# EAGLE design Servo-SMD (EAGLE 7.5.0)
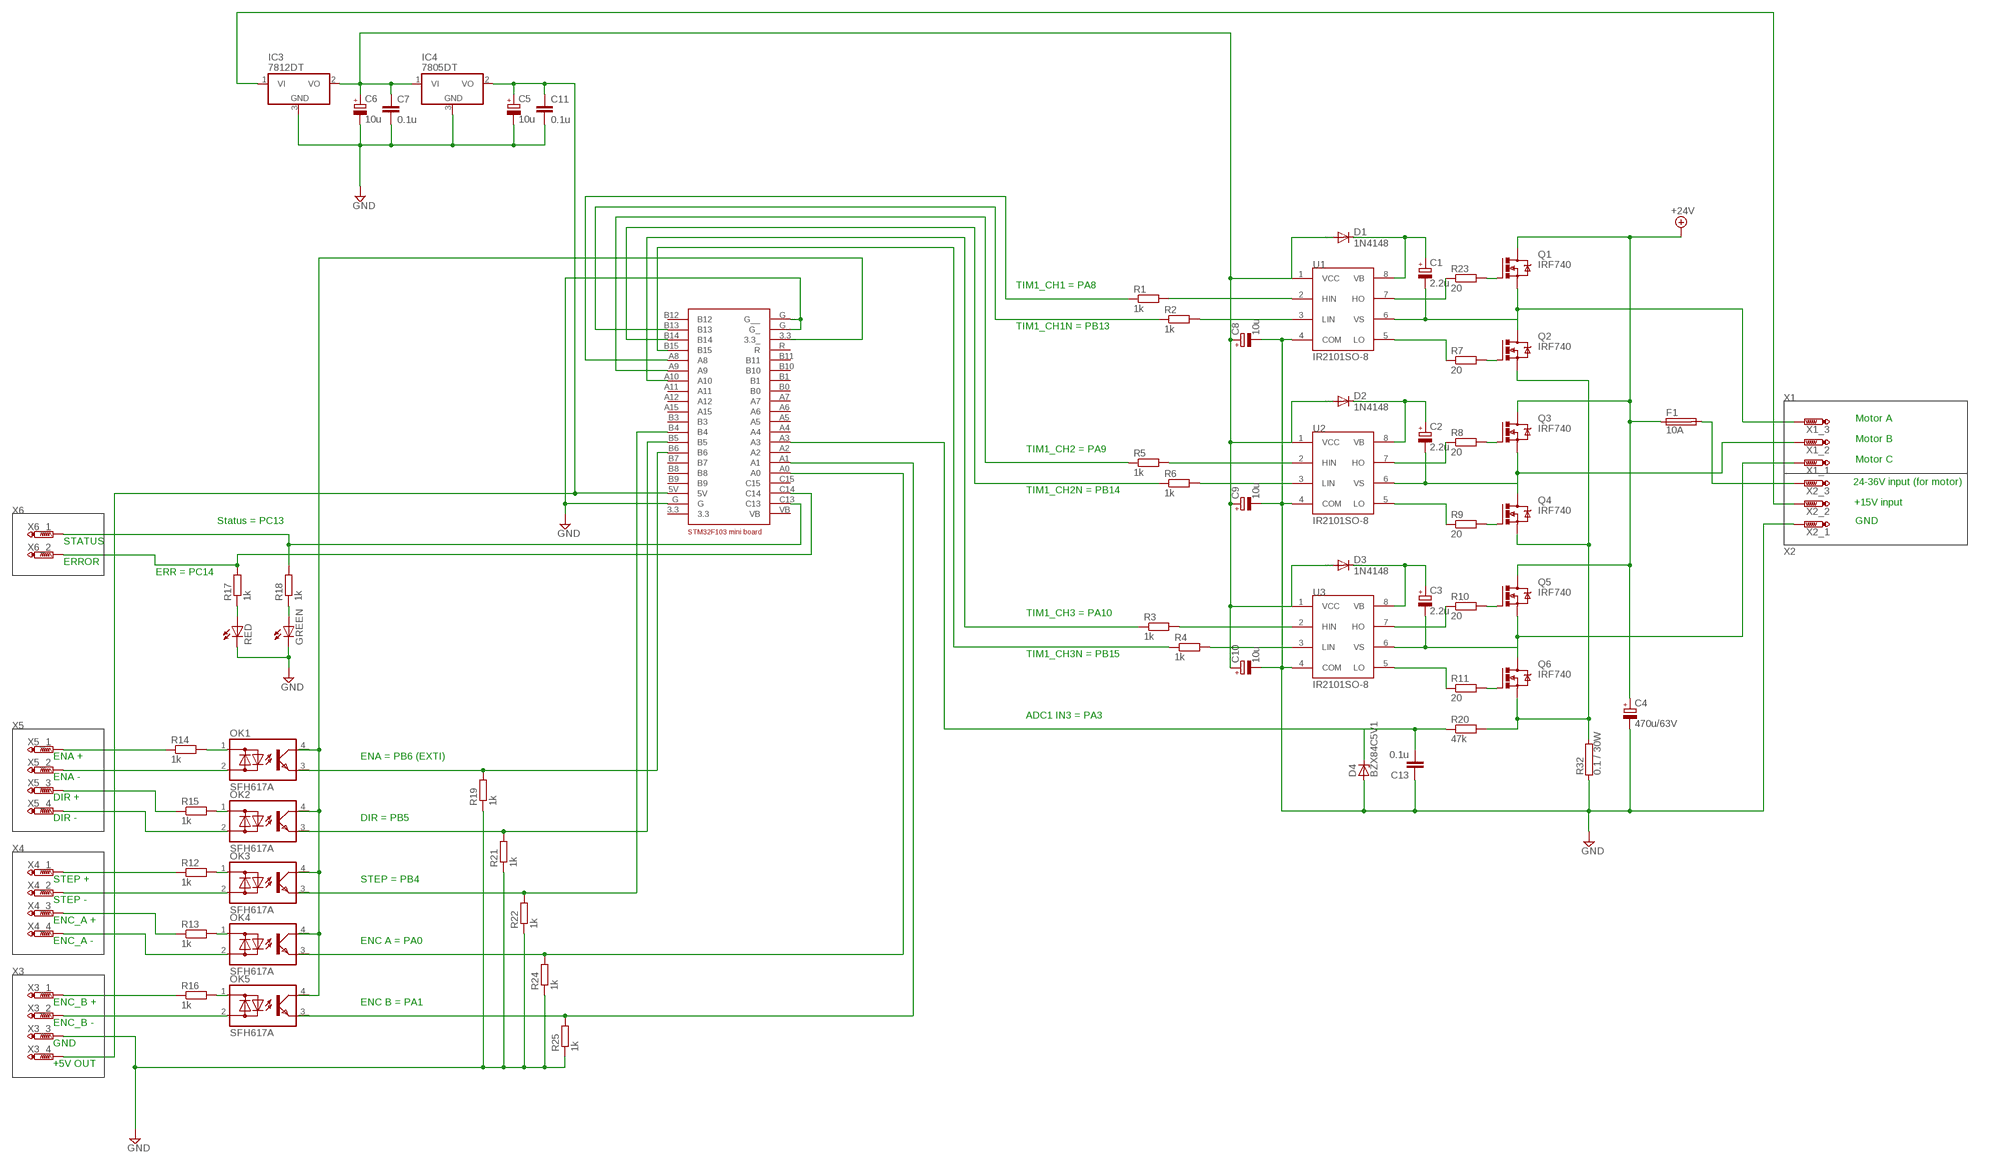
[diagram p0: schematic, sheet 1]

## Parts
C1  2.2u  CPOL-EUSANYO_SMD_C6  [SANYO-OSCON_SMD_C6]
C2  2.2u  CPOL-EUSANYO_SMD_C6  [SANYO-OSCON_SMD_C6]
C3  2.2u  CPOL-EUSANYO_SMD_C6  [SANYO-OSCON_SMD_C6]
C4  470u/63V  CPOL-EUE5-13  [E5-13]
C5  10u  CPOL-EUSANYO_SMD_C6  [SANYO-OSCON_SMD_C6]
C6  10u  CPOL-EUSANYO_SMD_C6  [SANYO-OSCON_SMD_C6]
C7  0.1u  C-EUC0805  [C0805]
C8  10u  CPOL-EUSANYO_SMD_C6  [SANYO-OSCON_SMD_C6]
C9  10u  CPOL-EUSANYO_SMD_C6  [SANYO-OSCON_SMD_C6]
C10  10u  CPOL-EUSANYO_SMD_C6  [SANYO-OSCON_SMD_C6]
C11  0.1u  C-EUC0805  [C0805]
C13  0.1u  C-EUC0805  [C0805]
D1  1N4148  CGRM4001-G  [SOD-123_MINI-SMA]
D2  1N4148  CGRM4001-G  [SOD-123_MINI-SMA]
D3  1N4148  CGRM4001-G  [SOD-123_MINI-SMA]
D4  BZX84C5V1  BZX84CSMD  [TO236]
F1  10A  FUSESHK20L  [SHK20L]
GREEN  LEDSML0805  [SML0805]
IC3  7812DT  7805DT  [TO252]
IC4  7805DT  7812DT  [TO252]
OK1  SFH617A  SFH6206  [DIL4-SMD]
OK2  SFH617A  SFH6206  [DIL4-SMD]
OK3  SFH617A  SFH6206  [DIL4-SMD]
OK4  SFH617A  SFH6206  [DIL4-SMD]
OK5  SFH617A  SFH6206  [DIL4-SMD]
Q1  IRF740  [TO220BV]
Q2  IRF740  [TO220BV]
Q3  IRF740  [TO220BV]
Q4  IRF740  [TO220BV]
Q5  IRF740  [TO220BV]
Q6  IRF740  [TO220BV]
R1  1k  R-EU_M0805  [M0805]
R2  1k  R-EU_M0805  [M0805]
R3  1k  R-EU_M0805  [M0805]
R4  1k  R-EU_M0805  [M0805]
R5  1k  R-EU_M0805  [M0805]
R6  1k  R-EU_M0805  [M0805]
R7  20  R-EU_M0805  [M0805]
R8  20  R-EU_M0805  [M0805]
R9  20  R-EU_M0805  [M0805]
R10  20  R-EU_M0805  [M0805]
R11  20  R-EU_M0805  [M0805]
R12  1k  R-EU_M0805  [M0805]
R13  1k  R-EU_M0805  [M0805]
R14  1k  R-EU_M0805  [M0805]
R15  1k  R-EU_M0805  [M0805]
R16  1k  R-EU_M0805  [M0805]
R17  1k  R-EU_M0805  [M0805]
R18  1k  R-EU_M0805  [M0805]
R19  1k  R-EU_M0805  [M0805]
R20  47k  R-EU_M0805  [M0805]
R21  1k  R-EU_M0805  [M0805]
R22  1k  R-EU_M0805  [M0805]
R23  20  R-EU_M0805  [M0805]
R24  1k  R-EU_M0805  [M0805]
R25  1k  R-EU_M0805  [M0805]
R32  0.1 / 30W  R  [TO220-2]
RED  LEDSML0805  [SML0805]
U1  IR2101SO-8  [SO-8]
U2  IR2101SO-8  [SO-8]
U3  IR2101SO-8  [SO-8]
U$1  STM32F108  [STB32F108BRD]
X1_1  PTR1PAD1-13Y  [P1-13Y]
X1_2  PTR1PAD1-13Y  [P1-13Y]
X1_3  PTR1PAD1-13Y  [P1-13Y]
X2_1  PTR1PAD1-13Y  [P1-13Y]
X2_2  PTR1PAD1-13Y  [P1-13Y]
X2_3  PTR1PAD1-13Y  [P1-13Y]
X3_1  PTR1PAD1-13Y  [P1-13Y]
X3_2  PTR1PAD1-13Y  [P1-13Y]
X3_3  PTR1PAD1-13Y  [P1-13Y]
X3_4  PTR1PAD1-13Y  [P1-13Y]
X4_1  PTR1PAD1-13Y  [P1-13Y]
X4_2  PTR1PAD1-13Y  [P1-13Y]
X4_3  PTR1PAD1-13Y  [P1-13Y]
X4_4  PTR1PAD1-13Y  [P1-13Y]
X5_1  PTR1PAD1-13Y  [P1-13Y]
X5_2  PTR1PAD1-13Y  [P1-13Y]
X5_3  PTR1PAD1-13Y  [P1-13Y]
X5_4  PTR1PAD1-13Y  [P1-13Y]
X6_1  PTR1PAD1-13Y  [P1-13Y]
X6_2  PTR1PAD1-13Y  [P1-13Y]

## Nets
+12V: IC3.1(VI) X2_2.TP
+24V: C4.+ F1.1A Q1.D Q3.D Q5.D
GND: C4.- C5.- C6.- C7.2 C8.- C9.- C10.- C11.2 C13.1 D4.A GREEN.C IC3.3(GND) IC4.3(GND) R19.1 R21.1 R22.1 R24.1 R25.1 R32.P$1 RED.C U1.4(COM) U2.4(COM) U3.4(COM) U$1.G U$1.G_ U$1.G__ X2_1.TP X3_3.TP
N$1: OK3.1(AC1) R12.2
N$2: OK4.1(AC1) R13.2
N$3: R1.1 U$1.A8
N$4: R2.1 U$1.B13
N$5: R5.1 U$1.A9
N$6: R6.1 U$1.B14
N$7: R3.1 U$1.A10
N$8: R4.1 U$1.B15
N$9: R2.2 U1.3(LIN)
N$10: R1.2 U1.2(HIN)
N$11: R5.2 U2.2(HIN)
N$12: R6.2 U2.3(LIN)
N$13: R4.2 U3.3(LIN)
N$14: R3.2 U3.2(HIN)
N$15: R23.1 U1.7(HO)
N$16: OK1.1(AC1) R14.2
N$17: R7.1 U1.5(LO)
N$18: R9.1 U2.5(LO)
N$19: R8.1 U2.7(HO)
N$20: R10.1 U3.7(HO)
N$21: R11.1 U3.5(LO)
N$22: C1.- Q1.S Q2.D U1.6(VS) X1_3.TP
N$23: C2.- Q3.S Q4.D U2.6(VS) X1_2.TP
N$24: C3.- Q5.S Q6.D U3.6(VS) X1_1.TP
N$25: Q1.G R23.2
N$26: Q2.G R7.2
N$27: Q3.G R8.2
N$28: Q4.G R9.2
N$29: Q5.G R10.2
N$30: Q6.G R11.2
N$31: OK2.1(AC1) R15.2
N$32: C5.+ C11.1 IC4.2(VO) U$1.5V X3_4.TP
N$33: OK5.1(AC1) R16.2
N$34: R12.1 X4_1.TP
N$35: OK3.2(AC2) X4_2.TP
N$36: R13.1 X4_3.TP
N$37: OK4.2(AC2) X4_4.TP
N$38: R14.1 X5_1.TP
N$39: OK1.2(AC2) X5_2.TP
N$40: Q2.S Q4.S Q6.S R20.2 R32.P$2
N$41: R15.1 X5_3.TP
N$42: OK2.2(AC2) X5_4.TP
N$43: R16.1 X3_1.TP
N$44: OK5.2(AC2) X3_2.TP
N$45: OK1.4(C) OK2.4(C) OK3.4(C) OK4.4(C) OK5.4(C) U$1.3.3_
N$46: OK5.3(E) R25.2 U$1.A1
N$47: OK4.3(E) R24.2 U$1.A0
N$48: OK3.3(E) R22.2 U$1.B4
N$49: OK2.3(E) R21.2 U$1.B5
N$50: OK1.3(E) R19.2 U$1.B6
N$51: R17.2 U$1.C14 X6_2.TP
N$52: R18.2 U$1.C13 X6_1.TP
N$53: R17.1 RED.A
N$54: GREEN.A R18.1
N$57: F1.2A X2_3.TP
N$59: C13.2 D4.C R20.1 U$1.A3
VB1: C1.+ D1.C U1.8(VB)
VB2: C2.+ D2.C U2.8(VB)
VB3: C3.+ D3.C U3.8(VB)
VCC: C6.+ C7.1 C8.+ C9.+ C10.+ D1.A D2.A D3.A IC3.2(VO) IC4.1(VI) U1.1(VCC) U2.1(VCC) U3.1(VCC)
Unconnected: U$1.3.3 U$1.A2 U$1.A4 U$1.A5 U$1.A6 U$1.A7 U$1.A11 U$1.A12 U$1.A15 U$1.B0 U$1.B1 U$1.B3 U$1.B7 U$1.B8 U$1.B9 U$1.B10 U$1.B11 U$1.B12 U$1.C15 U$1.R U$1.VB

## Notes on the sheet
- TIM1_CH1 = PA8
- TIM1_CH1N = PB13
- X1
- Motor A
- Motor B
- TIM1_CH2 = PA9
- Motor C
- 24-36V input (for motor)
- TIM1_CH2N = PB14
- +15V input
- X6
- Status = PC13 | GND
- STATUS
- X2
- ERROR
- ERR = PC14
- TIM1_CH3 = PA10
- TIM1_CH3N = PB15
- ADC1 IN3 = PA3
- X5
- ENA + | ENA = PB6 (EXTI)
- ENA -
- DIR +
- DIR - | DIR = PB5
- X4
- STEP + | STEP = PB4
- STEP -
- ENC_A +
- ENC_A - | ENC A = PA0
- X3
- ENC_B + | ENC B = PA1
- ENC_B -
- GND
- +5V OUT

## Library data of the parts
C1-C6 C8-C10 = rcl:CPOL-EU: POLARIZED CAPACITOR, European symbol
C7 C11 C13 = rcl:C-EU: CAPACITOR, European symbol
D1-D3 = diode:CGRM400*-G: Molded plasitc,JEDEC SOD-123/Mini SMA Source: Comchip CGRM4001-G.pdf
D4 = diode:BZX84CSMD: Z DIODE
F1 = fuse:FUSE: Fuse; OC_FARNELL: unknown; OC_NEWARK: unknown
GREEN RED = led:LED: LED OSRAM: - CHIPLED LG R971, LG N971, LY N971, LG Q971, LY Q971, LO R971, LY R971 LH N974, LH R974 LS Q976, LO Q976, LY Q976 LO Q996 - Hyper CHIPLED LW Q18S LB Q993, LB Q99A, LB R99A - SideLED LS A670, LO A670, LY A670, LG A670, LP A670 LB A673, LV A673, LT A673, LW A673 LH A674 LY A675 LS A676, LA A676, LO A676, LY A676, LW A676 LS A679, LY A679, LG A679 - Hyper Micro SIDELED® LS Y876, LA Y876, LO Y876, LY Y876 LT Y87S - SmartLED LW L88C, LW L88S LB L89C, LB L89S, LG L890 LS L89K, LO L89K, LY L89K LS L896, LA L896, LO L896, LY L896 - TOPLED LS T670, LO T670, LY T670, LG T670, LP T670 LSG T670, LSP T670, LSY T670, LOP T670, LYG T670 LG T671, LOG T671, LSG T671 LB T673, LV T673, LT T673, LW T673 LH T674 LS T676, LA T676, LO T676, LY T676, LB T676, LH T676, LSB T676, LW T676 LB T67C, LV T67C, LT T67C, LS T67K, LO T67K, LY T67K, LW E67C LS E67B, LA E67B, LO E67B, LY E67B, LB E67C, LV E67C, LT E67C LW T67C LS T679, LY T679, LG T679 LS T770, LO T770, LY T770, LG T770, LP T770 LB T773, LV T773, LT T773, LW T773 LH T774 LS E675, LA E675, LY E675, LS T675 LS T776, LA T776, LO T776, LY T776, LB T776 LHGB T686 LT T68C, LB T68C - Hyper Mini TOPLED® LB M676 - Mini TOPLED Santana® LG M470 LS M47K, LO M47K, LY M47K Source: http://www.osram.convergy.de LUXEON: - LUMILED® LXK2-PW12-R00, LXK2-PW12-S00, LXK2-PW14-U00, LXK2-PW14-V00 LXK2-PM12-R00, LXK2-PM12-S00, LXK2-PM14-U00 LXK2-PE12-Q00, LXK2-PE12-R00, LXK2-PE12-S00, LXK2-PE14-T00, LXK2-PE14-U00 LXK2-PB12-K00, LXK2-PB12-L00, LXK2-PB12-M00, LXK2-PB14-N00, LXK2-PB14-P00, LXK2-PB14-Q00 LXK2-PR12-L00, LXK2-PR12-M00, LXK2-PR14-Q00, LXK2-PR14-R00 LXK2-PD12-Q00, LXK2-PD12-R00, LXK2-PD12-S00 LXK2-PH12-R00, LXK2-PH12-S00 LXK2-PL12-P00, LXK2-PL12-Q00, LXK2-PL12-R00 Source: www.luxeon.com KINGBRIGHT: KA-3528ASYC Source: www.kingbright.com
IC3 IC4 = linear:78*: Positive VOLTAGE REGULATOR Source: http://cache.national.com/ds/LM/LM78L05.pdf http://www.fairchildsemi.com/ds/LM/LM7805.pdf
OK1-OK5 = optocoupler:SFH620: Optocoupler, Phototransistor Output, AC Input Source: http://www.vishay.com/docs/83675/sfh620.pdf; MF: VISHAY/TELEFUNKEN; MPN: SFH6206-3; OC_FARNELL: 1469585; OC_NEWARK: 58K2214
Q1-Q6 = transistor-power:IRF740: N-CHANNEL MOS FET
R1-R6 R12-R22 R24 R25 = resistor:R-EU_: RESISTOR, European symbol
R7-R11 R23 = rcl:R-EU_: RESISTOR, European symbol
R32 = TO220-Resistor:R: Power Resitor
U1-U3 = irf:IR2101: High and low side driver
U$1 = ATMega644:STM32F108
X1_1-X1_3 X2_1-X2_3 X3_1-X3_4 X4_1-X4_4 X5_1-X5_4 X6_1 X6_2 = testpad:PTR1: TEST PIN

## Net classes
0 default: clearance 0.205 mm

## Board
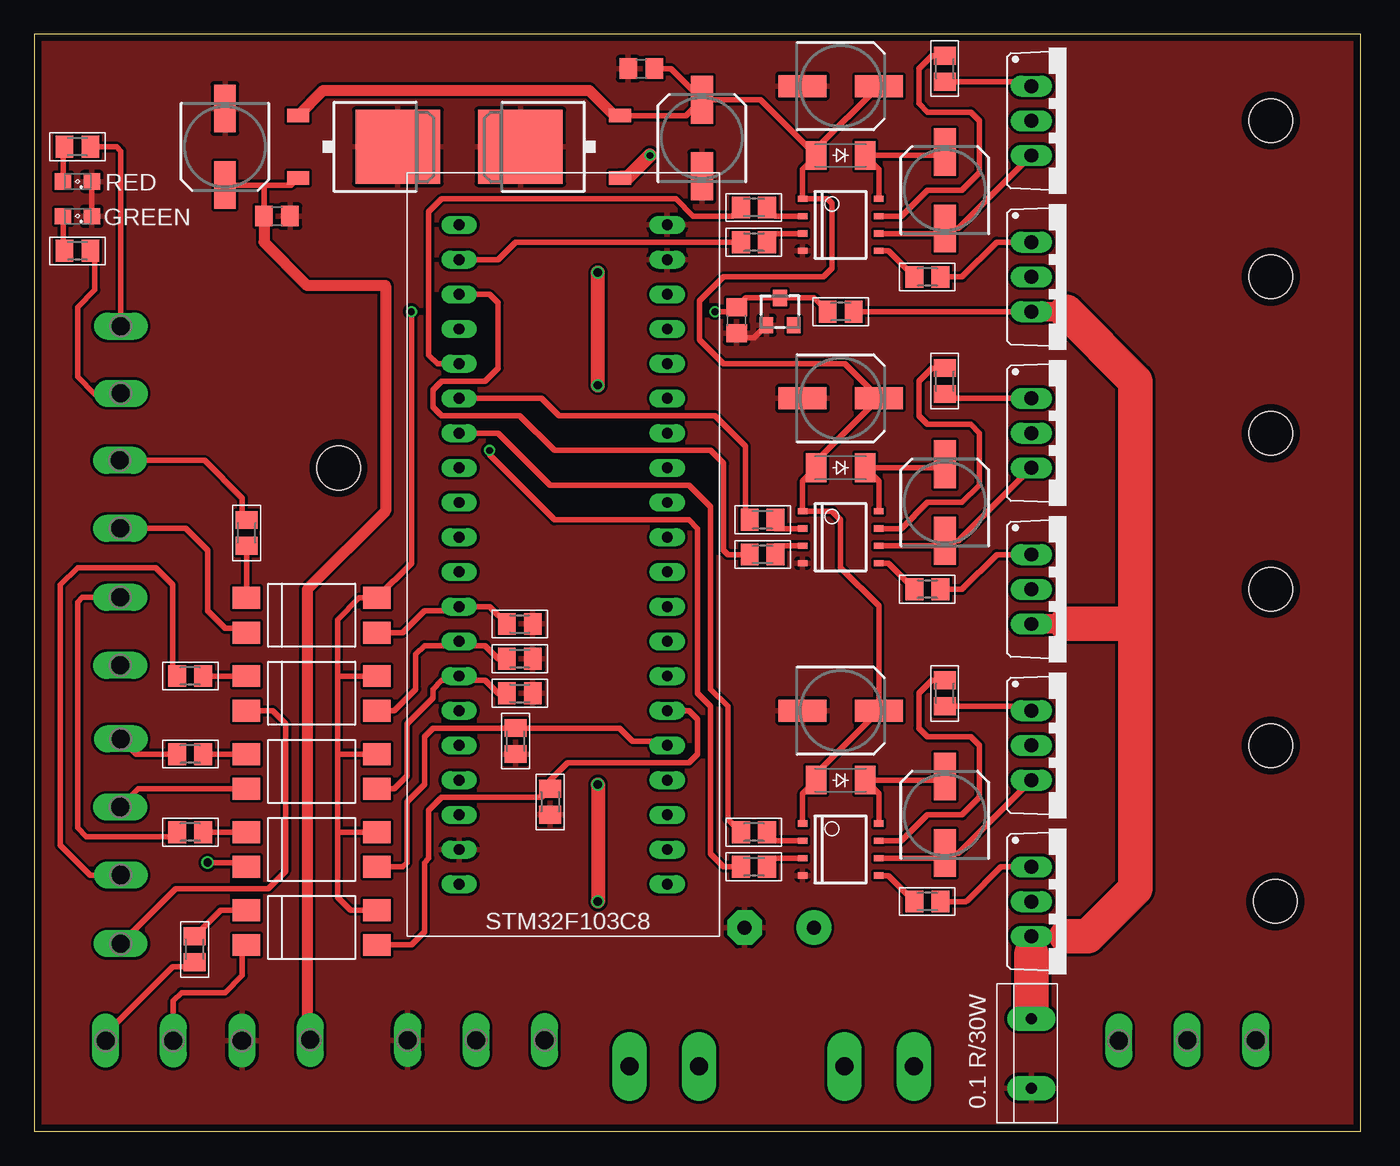
[diagram p1: board, top side]
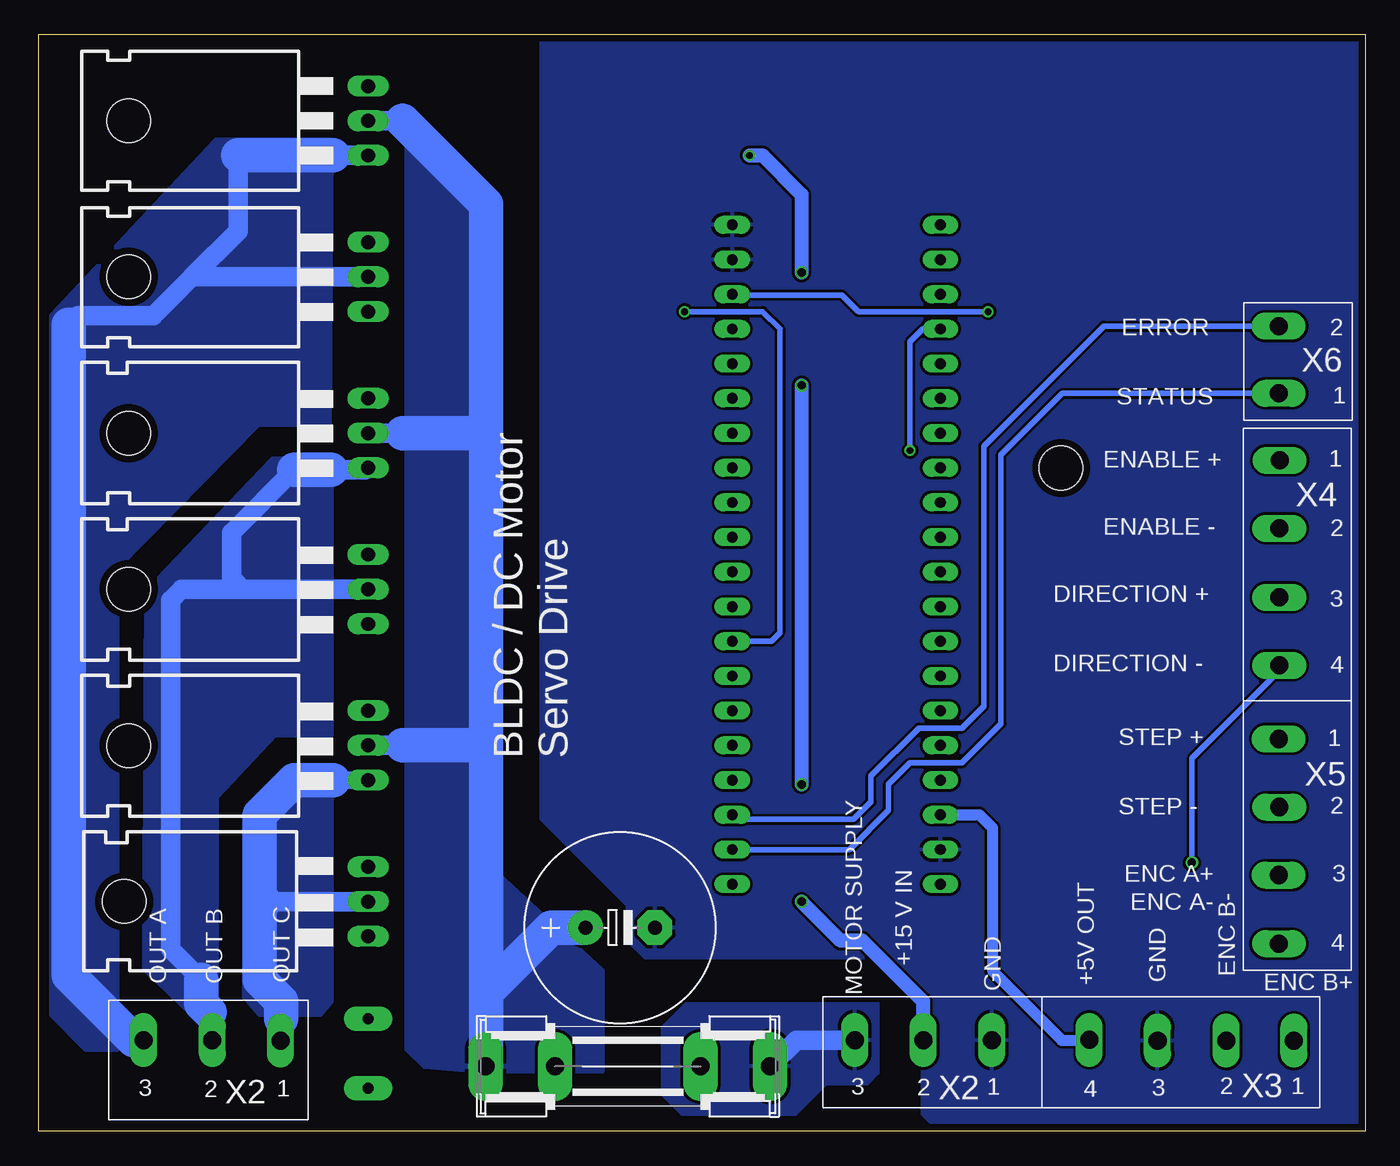
[diagram p2: board, bottom side, seen from below]

Size 97.14 x 80.32 mm. Coordinates in mm from the lower left corner, seen from the top.
Outline: 0,0 97.14,0 97.14,80.32 0,80.32 0,0
Copper layers (1*16): Top 0.035mm / dielectric 1.5mm / Bottom 0.035mm
Design rules "EagleRules": minimum track width 7mil, minimum drill 12mil, track to track 7mil, track to pad 7mil, pad to pad 7mil, via to via 7mil, smd to smd 0mil, copper to edge 20mil, drill to drill 10mil, minimum pad ring 10mil, minimum via ring 6mil, stop-mask expansion 2mil, vias tented up to drill 25mil, thermal gap 10mil
Holes 3.2 mm at 90.55,73.99 90.55,62.56 90.55,51.1 90.55,39.7 90.55,28.24 90.88,16.84 22.29,48.56

### Footprints (pad centres in the part's own frame; a part is rotated, then mirrored left to right if it is on the bottom)
SANYO-OSCON_SMD_C6 = smd 3.5 x 1.6: + 2.8,0; - -2.8,0
E5-13 = drill 1.016 pad 2.54: + -2.54,0 | drill 1.016 pad 2.54 octagon: - 2.54,0
C0805 = smd 1.3 x 1.5: 1 -0.95,0; 2 0.95,0
SOD-123_MINI-SMA = smd 1.5 x 2.1: A 1.8,0; C -1.8,0
TO236 = smd 1 x 1.2: A -1,-1; C 0,1; NC 1,-1
SHK20L = drill 1.321 pad 2.54 long: 1A -10.414,0; 1B -5.334,0; 2A 10.414,0; 2B 5.334,0
SML0805 = smd 1.2 x 1.2: A 1.05,0; C -1.05,0
TO252 = smd 1 x 1.6: 1 -2.28,-4.8; 2 2.28,-4.8 | smd 5.4 x 6.2: 3 0,2.5
DIL4-SMD = smd 1.6 x 2: 1 -1.27,-4.77; 2 1.27,-4.77; 3 1.27,4.77; 4 -1.27,4.77
TO220BV = drill 1.016 long: D 0,-2.54; G -2.54,-2.54; S 2.54,-2.54
M0805 = smd 1.3 x 1.6: 1 -0.95,0; 2 0.95,0
TO220-2 = drill 0.8 pad 1.778 long: P$1 -2.54,0; P$2 2.54,0
SO-8 = smd 0.7 x 0.45: 1 -2.79,1.905; 2 -2.79,0.635; 3 -2.79,-0.635; 4 -2.79,-1.905; 5 2.79,-1.905; 6 2.79,-0.635; 7 2.79,0.635; 8 2.79,1.905
STB32F108BRD = drill 0.8 long: 3.3 -7.62,-25.4; 3.3_ 7.62,17.78; 5V -7.62,-20.32; A0 7.62,-15.24; A1 7.62,-12.7; A2 7.62,-10.16; A3 7.62,-7.62; A4 7.62,-5.08; A5 7.62,-2.54; A6 7.62,0; A7 7.62,2.54; A8 -7.62,12.7; A9 -7.62,10.16; A10 -7.62,7.62; A11 -7.62,5.08; A12 -7.62,2.54; A15 -7.62,0; B0 7.62,5.08; B1 7.62,7.62; B3 -7.62,-2.54; B4 -7.62,-5.08; B5 -7.62,-7.62; B6 -7.62,-10.16; B7 -7.62,-12.7; B8 -7.62,-15.24; B9 -7.62,-17.78; B10 7.62,10.16; B11 7.62,12.7; B12 -7.62,22.86; B13 -7.62,20.32; B14 -7.62,17.78; B15 -7.62,15.24; C13 7.62,-22.86; C14 7.62,-20.32; C15 7.62,-17.78; G -7.62,-22.86; G_ 7.62,20.32; G__ 7.62,22.86; R 7.62,15.24; VB 7.62,-25.4
P1-13Y = drill 1.321 pad 1.905 long: TP 0,0

### Placement (x,y rotation side)
C1  66.67,68.9 90 top
C2  66.67,46.04 90 top
C3  66.67,23.18 90 top
C4  54.56,14.92 0 bottom
C5  13.97,72.07 270 top
C6  48.9,72.71 90 top
C7  44.45,77.79 180 top
C8  59.05,76.52 0 top
C9  59.05,53.66 0 top
C10  59.05,30.8 0 top
C11  17.78,66.99 0 top
C13  51.44,59.37 90 top
D1  59.05,71.44 180 top
D2  59.05,48.58 180 top
D3  59.05,25.72 180 top
D4  54.61,60.01 0 top
F1  54,4.76 0 bottom
GREEN  3.17,66.99 180 top
IC3  38.1,72.07 90 top
IC4  24.13,72.07 270 top
OK1  20.32,26.35 270 top
OK2  20.32,32.07 270 top
OK3  20.32,37.78 270 top
OK4  20.32,20.64 270 top
OK5  20.32,14.92 270 top
Q1  75.56,73.98 270 top
Q2  75.56,62.55 270 top
Q3  75.56,51.12 270 top
Q4  75.56,39.69 270 top
Q5  75.56,28.26 270 top
Q6  75.56,16.83 270 top
R1  52.7,67.63 0 top
R2  52.7,65.09 0 top
R3  52.7,21.91 0 top
R4  52.7,19.37 0 top
R5  53.34,44.77 0 top
R6  53.34,42.23 0 top
R7  65.41,62.55 0 top
R8  66.67,54.93 270 top
R9  65.41,39.69 0 top
R10  66.67,32.07 270 top
R11  65.41,16.83 0 top
R12  15.56,43.81 270 top
R13  11.43,21.91 0 top
R14  11.43,27.62 0 top
R15  11.43,33.34 0 top
R16  11.75,13.34 90 top
R17  3.17,72.07 0 top
R18  3.17,64.45 0 top
R19  35.56,32.07 180 top
R20  59.05,60.01 0 top
R21  35.56,34.61 180 top
R22  35.56,37.15 180 top
R23  66.67,77.79 270 top
R24  35.24,28.57 90 top
R25  37.78,24.13 90 top
R32  73.03,5.71 90 top
RED  3.17,69.53 180 top
U1  59.05,66.36 0 top
U2  59.05,43.5 0 top
U3  59.05,20.64 0 top
U$1  38.73,43.5 0 top
X1_1  79.43,6.65 0 top
X1_2  84.43,6.68 0 top
X1_3  89.46,6.68 0 top
X2_1  27.36,6.68 0 top
X2_2  32.36,6.68 0 top
X2_3  37.39,6.68 0 top
X3_1  5.23,6.65 0 top
X3_2  10.19,6.65 0 top
X3_3  15.21,6.65 0 top
X3_4  20.22,6.71 0 top
X4_1  6.27,49.12 90 top
X4_2  6.3,44.15 90 top
X4_3  6.3,39.09 90 top
X4_4  6.3,34.11 90 top
X5_1  6.35,28.73 90 top
X5_2  6.3,23.75 90 top
X5_3  6.35,18.77 90 top
X5_4  6.32,13.74 90 top
X6_1  6.35,54.03 270 top
X6_2  6.35,58.95 270 top

### Tracks (layer width: path | path; a pad name or v marks a point on that pad's centre or on a via)
+12V  (via drill 0.5, 0.6)
  Top 1.016: v41.27,54.61 v41.27,62.87 | v45.09,71.44 43.44,69.79 IC3.1 | v41.27,25.4 v41.27,16.83
  Bottom 1.016: X2_2.TP arc45 32.38,6.74 32.38,9.53 36.83,13.97 38.42,13.97 v41.27,16.83 | v45.09,71.44 44.13,71.44 41.27,68.58 v41.27,62.87 | v41.27,54.61 v41.27,25.4
+24V
  Bottom 1.422: Q1.D 70.48,73.98 | Q3.D 70.48,51.12 | Q5.D 70.48,28.26
  Bottom 2.54: 70.48,73.98 64.39,67.88 64.39,51.12 | 64.39,51.12 64.39,28.26 | 70.48,51.12 64.39,51.12 | 70.48,28.26 64.39,28.26 | 64.39,28.26 64.39,10.16 | 64.39,10.16 64.39,4.79 F1.1A | C4.+ 59.63,14.92 64.39,10.16
  pour Bottom: 70.17,73.66 70.17,6.03 68.9,4.76 65.09,4.45 55.88,4.45 55.88,11.75 64.45,19.68 64.45,67.94
GND
  Top 0.406: D4.A 52.7,58.1 51.76,58.1 C13.1 | RED.C GREEN.C
  pour Top: -0.64,80.33 -0.6,-0.06 97.19,-0.06 97.16,80.33
  pour Bottom: -0.64,80.01 -0.64,0 31.11,0 32.38,1.27 32.38,8.89 36.2,12.7 52.7,12.7 53.98,13.97 53.98,16.51 60.33,22.86 60.33,80.01
N$1
  Top 0.406: OK3.1 R12.2
N$2
  Top 0.406: OK4.1 R13.2
N$3
  Top 0.406: R1.1 51.12,66.99 48.26,66.99 46.99,68.26 29.84,68.26 28.89,67.31 28.89,56.83 29.53,56.2 U$1.A8
N$4
  Top 0.406: U$1.B13 33.97,63.82 35.24,65.09 R2.1
N$5
  Top 0.406: R5.1 52.07,45.09 52.07,50.16 49.85,52.39 38.42,52.39 37.15,53.66 U$1.A9
N$6
  Top 0.406: R6.1 50.8,42.23 50.48,42.55 50.48,48.9 49.53,49.85 38.1,49.85 35.56,52.39 29.84,52.39 29.21,53.02 29.21,54.29 29.84,54.93 33.02,54.93 33.97,55.88 33.97,60.64 33.34,61.28 U$1.B14
N$7
  Top 0.406: U$1.A10 33.97,51.12 37.78,47.31 47.94,47.31 49.53,45.72 49.53,32.38 50.8,31.11 50.8,22.86 R3.1
N$8  (via drill 0.5)
  Top 0.406: R4.1 50.48,19.37 49.53,20.32 49.53,31.11 48.58,32.07 48.58,44.13 47.94,44.77 38.1,44.77 33.34,49.53 v33.34,49.85
  Bottom 0.406: v33.34,49.85 33.34,57.78 32.38,58.74 U$1.B15
N$9
  Top 0.406: U1.3 54.29,65.72 R2.2
N$10
  Top 0.406: U1.2 54.29,66.99 R1.2
N$11
  Top 0.406: U2.2 54.29,44.13 R5.2
N$12
  Top 0.406: U2.3 54.29,42.86 R6.2
N$13
  Top 0.406: U3.3 54.29,20 R4.2
N$14
  Top 0.406: U3.2 54.29,21.27 R3.2
N$15
  Top 0.406: R23.1 65.72,78.74 64.77,77.79 64.77,75.25 65.41,74.61 68.58,74.61 69.22,73.98 69.22,70.17 67.94,68.9 65.41,68.9 63.5,66.99 U1.7
N$16
  Top 0.406: OK1.1 R14.2
N$17
  Top 0.406: U1.5 62.55,64.45 R7.1
N$18
  Top 0.406: U2.5 62.55,41.59 R9.1
N$19
  Top 0.406: R8.1 65.72,55.88 64.77,54.93 64.77,52.39 65.41,51.75 68.58,51.75 69.22,51.12 69.22,47.31 67.94,46.04 65.41,46.04 63.5,44.13 U2.7
N$20
  Top 0.406: R10.1 65.72,33.02 64.77,32.07 64.77,29.53 65.41,28.89 68.58,28.89 69.22,28.26 69.22,24.45 67.94,23.18 65.41,23.18 63.5,21.27 U3.7
N$21
  Top 0.406: U3.5 62.55,18.73 R11.1
N$22
  Top 0.406: U1.6 66.3,65.72 C1.- 67.69,66.1 Q1.S
  Bottom 1.016: 90.17,6.67 89.49,6.67 arc-45 X1_3.TP
  Bottom 1.422: 75.56,71.44 Q1.S | 75.56,62.55 Q2.D 85.88,62.55 | 82.55,71.44 82.55,65.88 85.88,62.55 | 85.88,62.55 88.74,59.69 94.3,59.69 94.93,59.05
  Bottom 2.54: 82.55,71.44 75.56,71.44 | 94.93,59.05 94.93,11.43 90.17,6.67
  pour Bottom: 75.72,72.55 75.88,51.75 81.12,51.75 91.44,41.27 91.44,6.03 93.66,6.03 96.2,8.57 96.2,59.69 84.14,72.55
N$23
  Top 0.406: U2.6 66.3,42.86 C2.- 67.69,43.24 Q3.S
  Bottom 1.27: Q4.D 75.56,39.69
  Bottom 1.422: 75.56,39.69 86.68,39.69 87.47,38.89 87.47,13.34 85.25,11.11 | 84.61,8.73 84.61,6.86 X1_2.TP | Q4.D 82.23,39.69 83.03,40.48 83.03,43.81 78.42,48.42 | 75.72,48.42 73.18,48.42 Q3.S
  Bottom 2.54: 85.25,11.11 85.25,9.37 84.61,8.73 | 78.42,48.42 75.72,48.42
  pour Bottom: 75.72,49.37 75.72,29.05 79.85,29.05 84.14,24.45 84.14,9.53 85.88,8.57 89.38,11.91 89.22,39.53 80.01,49.21
N$24
  Top 0.406: U3.6 66.3,20 C3.- 67.69,20.38 Q5.S
  Bottom 1.27: 75.56,25.72 Q5.S
  Bottom 1.422: 79.38,8.26 79.38,6.74 | Q6.D 80.64,16.83
  Bottom 2.54: 75.56,25.72 78.42,25.72 80.96,23.18 80.96,17.14 | 80.96,17.14 80.96,11.11 79.38,9.53 79.38,8.26 | 80.64,16.83 80.96,17.14
  pour Bottom: 75.72,25.72 75.72,9.53 76.52,8.57 80.96,8.57 82.07,9.84 82.07,22.54 79.06,25.72
N$25
  Top 0.406: R23.2 72.7,76.84 Q1.G
N$26
  Top 0.406: R7.2 67.94,62.55 70.48,65.09 Q2.G
N$27
  Top 0.406: Q3.G 67,53.66 R8.2
N$28
  Top 0.406: R9.2 67.94,39.69 70.48,42.23 Q4.G
N$29
  Top 0.406: R10.2 72.7,31.12 Q5.G
N$30
  Top 0.406: R11.2 68.13,16.83 arc45 68.36,16.92 70.8,19.37 Q6.G
N$31
  Top 0.406: OK2.1 R15.2
N$32
  Top 0.406: IC4.2 18.81,69.27 16.83,69.27 | 16.83,69.27 C5.+ | C11.1 16.83,69.27
  Top 0.762: 20.19,6.64 arc-45 X3_4.TP
  Top 0.813: C11.1 16.83,65.09 20,61.91 25.72,61.91 25.72,45.4 20,39.69 20,6.92 X3_4.TP
  Bottom 0.813: U$1.5V 28.26,23.18 27.3,22.23 27.3,11.75 22.23,6.67 20.26,6.67 X3_4.TP
N$33
  Top 0.406: OK5.1 13.65,16.19 R16.2
N$34
  Top 0.406: X4_1.TP 12.47,49.12 15.24,46.35 15.24,45.08 R12.1
N$35
  Top 0.406: X4_2.TP 11.1,44.15 12.7,42.55 12.7,38.1 13.97,36.83 15.23,36.83 OK3.2
N$36
  Top 0.406: X4_3.TP 3.53,39.09 3.17,38.73 3.17,22.23 3.81,21.59 10.16,21.59 R13.1
N$37  (via drill 0.6)
  Top 0.406: v12.7,19.68 15.23,19.68 OK4.2
  Bottom 0.406: 6.33,34.1 arc-45 X4_4.TP 6.3,33.71 12.7,27.3 v12.7,19.68
N$38
  Top 0.406: R14.1 7.46,27.62 X5_1.TP
N$39
  Top 0.406: OK1.2 7.63,25.08 X5_2.TP
N$40
  Top 0.406: Q2.S R20.2
  Top 0.61: 75.56,14.29 Q6.S
  Top 1.422: Q2.S 75.56,60.01 | Q4.S 75.56,37.15 | R32.P$2 73.03,9.21 | 73.03,13.02 Q6.S
  Top 2.54: 75.56,60.01 80.64,54.93 80.64,37.15 | 80.64,37.15 80.64,17.89 arc-45 80.57,17.71 77.15,14.29 75.56,14.29 | 75.56,37.15 80.64,37.15 | 73.03,9.21 73.03,13.02
N$41
  Top 0.406: X5_3.TP 4.09,18.77 1.91,20.95 1.91,40.01 3.17,41.27 8.89,41.27 10.16,40.01 10.16,33.66 R15.1
N$42
  Top 0.406: 9.2,16.61 arc45 9.21,16.64 10.35,17.78 10.36,17.78 | OK2.2 17.46,30.8 18.41,29.84 18.41,19.05 17.14,17.78 10.36,17.78 | 10.36,17.78 X5_4.TP
N$43
  Top 0.406: R16.1 11.43,12.06 10.16,12.06 5.23,7.14 X3_1.TP
N$44
  Top 0.406: X3_2.TP 10.19,9.55 10.79,10.16 13.97,10.16 15.24,11.43 15.24,13.34 OK5.2
N$45  (via drill 0.5)
  Top 0.406: OK5.4 23.18,16.19 22.23,17.14 22.23,21.91 | 22.23,21.91 22.23,27.62 | 22.23,27.62 22.23,33.34 | 22.23,33.34 22.23,37.47 23.81,39.05 OK3.4 27.62,41.59 v27.62,60.01 | OK2.4 22.23,33.34 | OK1.4 22.23,27.62 | OK4.4 22.23,21.91
  Bottom 0.406: v27.62,60.01 37.02,60.01 arc45 37.2,60.08 38.34,61.22 46.29,61.22 U$1.3.3_
N$46
  Top 0.406: U$1.A1 47.94,30.8 48.58,30.16 48.58,27.62 47.94,26.99 39.05,26.99 37.78,25.72 R25.2 37.15,24.45 29.84,24.45 28.89,23.5 28.89,20 28.57,19.68 28.57,14.61 27.62,13.65 OK5.3
N$47
  Top 0.406: U$1.A0 46.04,28.57 43.81,28.57 42.87,29.52 R24.2 29.21,29.53 28.57,28.89 28.57,25.4 27.3,24.13 27.3,19.68 26.99,19.37 OK4.3
N$48
  Top 0.406: R22.2 33.98,37.78 33.34,38.42 U$1.B4 30.8,38.1 28.57,38.1 26.99,36.51 OK3.3
N$49
  Top 0.406: R21.2 33.97,34.61 33.02,35.56 31.43,35.56 U$1.B5 30.8,35.56 28.57,35.56 27.94,34.92 27.94,32.38 26.35,30.8 OK2.3
N$50
  Top 0.406: R19.2 33.97,32.07 33.02,33.02 31.43,33.02 U$1.B6 30.8,33.02 29.84,33.02 29.21,32.38 29.21,31.75 27.3,29.84 27.3,26.04 26.35,25.08 OK1.3
N$51
  Top 0.406: R17.2 6.03,72.07 6.35,71.75 X6_2.TP
  Bottom 0.406: U$1.C14 46.04,22.86 37.47,22.86 36.2,24.13 36.2,26.04 32.7,29.53 29.53,29.53 27.94,31.11 27.94,50.16 19.15,58.95 X6_2.TP
N$52
  Top 0.406: 6.38,53.98 6.37,53.98 arc-45 X6_1.TP 6.3,53.98 4.45,53.98 3.17,55.24 3.17,60.33 4.45,61.59 4.45,64.13 R18.2
  Bottom 0.406: U$1.C13 37.78,20.64 34.92,23.5 34.92,25.4 33.34,26.99 29.53,26.99 26.67,29.84 26.67,49.53 22.17,54.03 X6_1.TP
N$53
  Top 0.406: R17.1 2.12,71.97 RED.A
N$54
  Top 0.406: R18.1 2.12,64.55 GREEN.A
N$57
  Bottom 1.422: X2_3.TP 41.67,6.68 F1.2A
  pour Bottom: 35.72,9.37 35.72,4.29 36.51,3.49 39.53,3.49 41.75,1.27 50.01,1.27 51.44,2.7 51.44,7.62 49.69,9.37
N$59  (via drill 0.5)
  Top 0.406: R20.1 57.1,61.01 D4.C 52.12,61.01 C13.2 51.12,60.01 v49.85,60.01
  Bottom 0.406: v49.85,60.01 44.13,60.01 42.86,58.74 42.86,36.51 43.5,35.88 U$1.A3
VB1
  Top 0.406: U1.8 61.84,70.45 D1.C 66.42,71.44 C1.+
VB2
  Top 0.406: U2.8 61.84,47.59 D2.C 66.42,48.58 C2.+
VB3
  Top 0.406: U3.8 61.84,24.73 D3.C 66.42,25.72 C3.+
VCC
  Top 0.406: D1.A 56.27,70.45 U1.1 58.1,68.26 58.42,67.94 58.42,63.18 57.78,62.55 50.48,62.55 48.74,60.8 48.74,57.94 50.48,56.2 59.37,56.2 61.85,53.72 C9.+ 57.26,49.06 D2.A 56.27,47.59 U2.1 58.42,45.4 59.05,44.77 59.05,41.27 61.85,38.48 C10.+ 57.26,26.2 D3.A 56.27,24.73 U3.1 | D1.A 57.26,71.92 C8.+ | IC3.2 47.74,74.35 C6.+ | C7.1 46.62,77.79 C6.+ | C6.+ 53.19,75.51 D1.A
  Top 0.813: IC4.1 21.18,76.2 40.64,76.2 42.49,74.35 IC3.2

### Text on the board
tPlace: STM32F103C8 | 0.1 R/30W
bPlace: 2 | ERROR | X6 | 1 | STATUS | 1 | ENABLE + | X4 | 2 | ENABLE - | DIRECTION + | 3 | 4 | DIRECTION - | 1 | STEP + | BLDC / DC Motor / Servo Drive | X5 | MOTOR SUPPLY | 2 | STEP - | ENC A+ | +15 V IN | 3 | +5V OUT | ENC B- | ENC A- | OUT C | OUT B | OUT A | GND | GND | 4 | ENC B+ | 1 | 2 | 3 | 4 | 1 | 2 | 3 | 1 | 3 | X3 | X2 | X2 | 2